# Altium schematic sheet Sheet1.SchDoc
size A4; SheetNumber: 1; SheetTotal: 1; SPICEModelCacheNBGVQPOM: <root> / <DocumentId>NBGVQPOM</DocumentId> / <CacheFrame Number="0"> / <Model Name="qnpn" Kind="MDL"> / <Text>*QNPN / *NPN Trans Pinout: C,B,E / .MODEL QNPN NPN(IS=3.2E-16 BF=141 VAF=35 ISE=2.6 NE=1.46 CJE=1E-13 / + MJE=0.333 TF=6E-11 CJC=1E-13 CJS=2.2E-13 MJS=0.5 FC=0.67 )</Text> / </Model> / </CacheFrame> / </root>
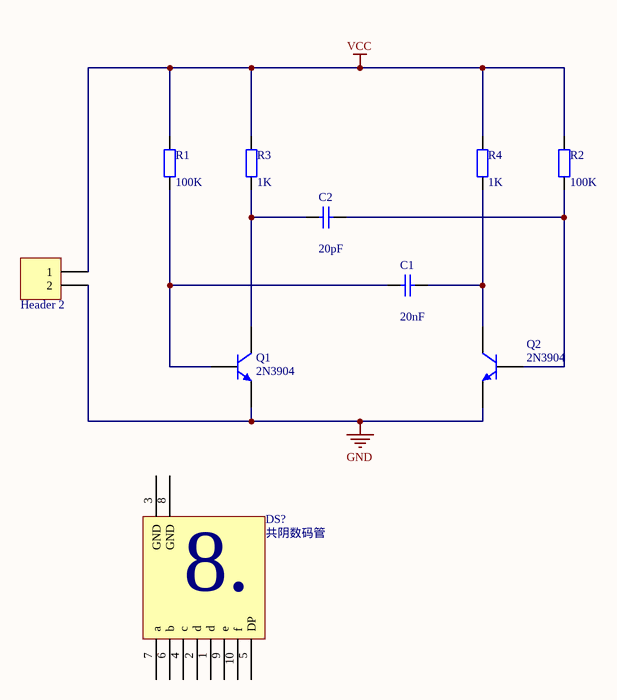
[diagram p0: Sheet1.SchDoc]

## Parts
C1  value 20nF  [RAD-0.3]  (hidden comment: Cap)
C2  value 20pF  [RAD-0.3]
DS?  共阴数码管  [SOP10]
P2  Header 2  [HDR1X2]
Q1  2N3904  [SOT-23B_N]
Q2  2N3904  [SOT-23B_N]
R1  value 100K  [AXIAL-0.4]
R2  value 100K  [AXIAL-0.4]
R3  value 1K  [AXIAL-0.4]
R4  value 1K  [AXIAL-0.4]

## Nets
GND: P2.2 Q1.3(E) Q2.3(E)
VCC: P2.1 R1.2 R2.2 R3.2 R4.2
NetC1_1: C1.1 Q1.2(B) R1.1
NetC1_2: C1.2 Q2.1(C) R4.1
NetC2_1: C2.1 Q1.1(C) R3.1
NetC2_2: C2.2 Q2.2(B) R2.1

Not connected (* = marked no-connect by the designer): DS? 1(d) 2(d) 3(GND) 4(c) 5(DP) 6(b) 7(a) 8(GND) 9(e) 10(f)

## Notes on the sheet
- (in symbol 数码管) 8.

## Library data of the parts
C1 C2 = Cap: Capacitor; Published: 8-Jun-2000; LatestRevisionDate: 17-Jul-2002; LatestRevisionNote: Re-released for DXP Platform.; PackageReference: RAD-0.3; Publisher: Altium Limited; PackageDescription: Radial Cap, Thru-Hole; 2 Leads; 0.3 in Pin Spacing
DS? = 数码管
P2 = Header 2: Header, 2-Pin; LatestRevisionDate: 17-Jul-2002; LatestRevisionNote: Re-released for DXP Platform.; Publisher: Altium Limited
Q1 Q2 = QNPN: NPN Bipolar Transistor; Published: 8-Jun-2000; LatestRevisionDate: 29-May-2009; LatestRevisionNote: IPC-7351 Footprint Added.; PackageVersion: Aug-1999; PackageReference: SOT-23B; Publisher: Altium Limited; PackageDescription: 3-Pin SOT-23 Package 0.95 mm Pitch, 2.4 mm Lead Span
R1-R4 = Res2: Resistor; Published: 8-Jun-2000; LatestRevisionDate: 17-Jul-2002; LatestRevisionNote: Re-released for DXP Platform.; PackageReference: AXIAL-0.4; Publisher: Altium Limited; PackageDescription: Axial Device, Thru-Hole; 2 Leads; 0.4 in Pin Spacing